# EAGLE design chipKIT Basic IO (EAGLE 5.11)

## Sheet 1 of 4
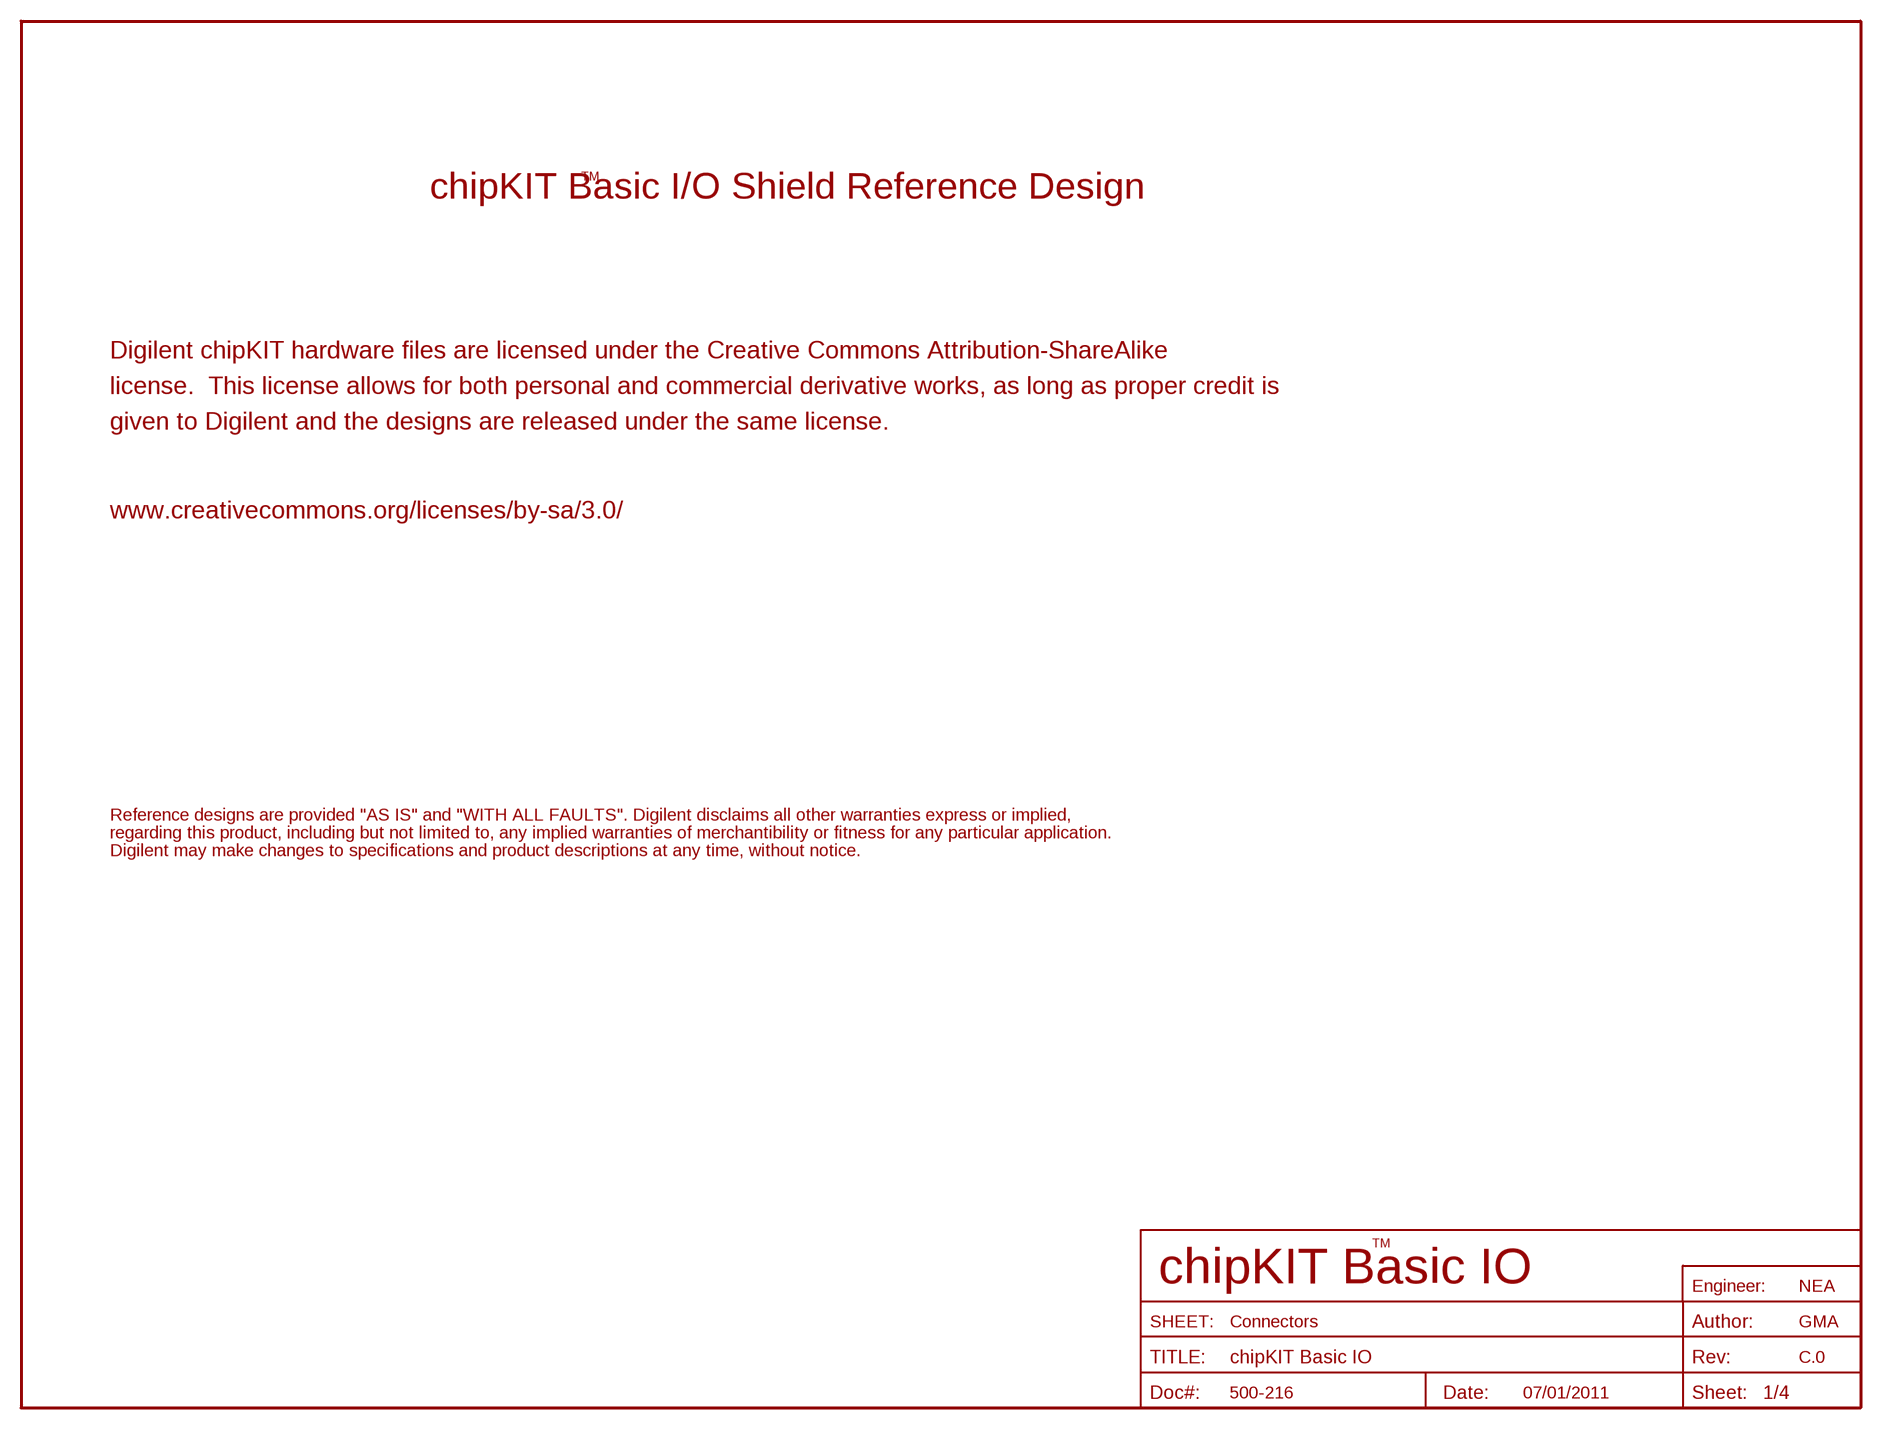
[diagram p0: schematic, sheet 1]

### Notes on the sheet
- TM
- chipKIT Basic I/O Shield Reference Design
- Digilent chipKIT hardware files are licensed under the Creative Commons Attribution-ShareAlike
- license.  This license allows for both personal and commercial derivative works, as long as proper credit is
- given to Digilent and the designs are released under the same license.
- www.creativecommons.org/licenses/by-sa/3.0/
- Reference designs are provided "AS IS" and "WITH ALL FAULTS". Digilent disclaims all other warranties express or implied,
- regarding this product, including but not limited to, any implied warranties of merchantibility or fitness for any particular application.
- Digilent may make changes to specifications and product descriptions at any time, without notice.
- TM
- chipKIT Basic IO
- NEA
- Connectors | GMA
- C.0
- 500-216 | 07/01/2011

## Sheet 2 of 4
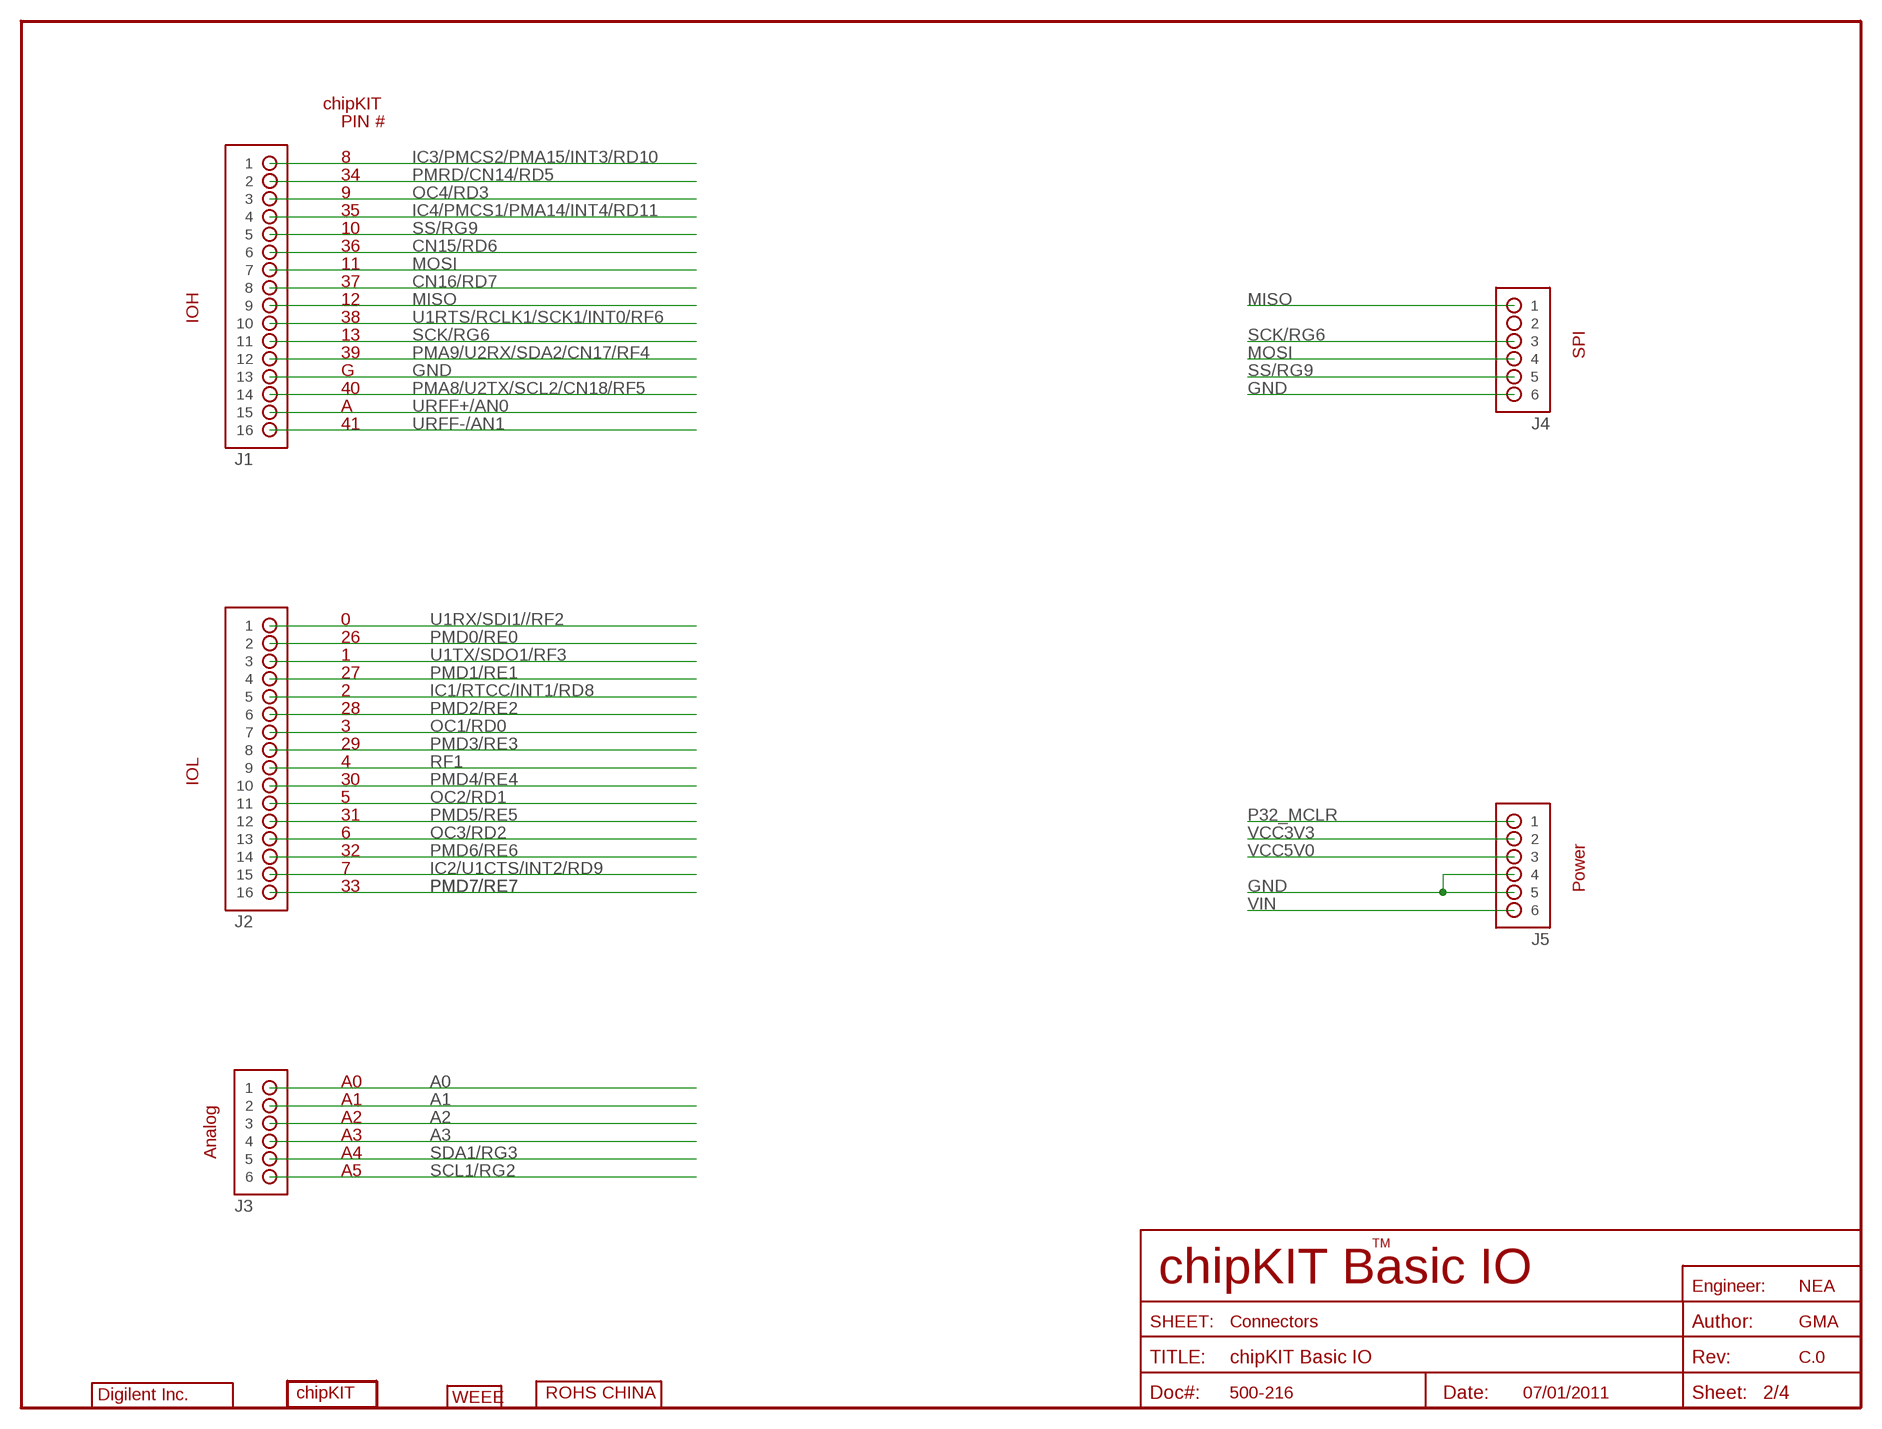
[diagram p1: schematic, sheet 2]

### Parts
J1  HDR-2X8  [HDR-2X8]
J2  HDR-2X8  [HDR-2X8]
J3  HDR-1X6  [HDR-1X6]
J4  No Load  HDR-2X3  [HDR-2X3]
J5  HDR-1X6  [HDR-1X6]
LOGO1  CHIPKIT  [CHIPKIT_LOGO]
LOGO2  DIGILENT_INC-1000  [DIGILENT_URL_1000_LOGO]
LOGO3  WEEE-L  [WEEE_LOGO2]
LOGO4  ROHS-CHINA  [ROHS_CHINA_LOGO]

### Nets
A0: J3.1 ; also sheet 4
A1: J3.2
A2: J3.3
A3: J3.4
CN15/RD6: J1.6 ; also sheet 3
CN16/RD7: J1.8 ; also sheet 3
GND: J1.13 J4.6 J5.4 J5.5 ; also sheet 3,4
IC1/RTCC/INT1/RD8: J2.5 ; also sheet 3
IC2/U1CTS/INT2/RD9: J2.15 ; also sheet 3
IC3/PMCS2/PMA15/INT3/RD10: J1.1 ; also sheet 3
IC4/PMCS1/PMA14/INT4/RD11: J1.4 ; also sheet 3
MISO: J1.9 J4.1
MOSI: J1.7 J4.4 ; also sheet 4
OC1/RD0: J2.7 ; also sheet 3
OC2/RD1: J2.11 ; also sheet 3
OC3/RD2: J2.13 ; also sheet 3
OC4/RD3: J1.3 ; also sheet 3
P32_MCLR: J5.1
PMA8/U2TX/SCL2/CN18/RF5: J1.14 ; also sheet 4
PMA9/U2RX/SDA2/CN17/RF4: J1.12 ; also sheet 4
PMD0/RE0: J2.2 ; also sheet 4
PMD1/RE1: J2.4 ; also sheet 4
PMD2/RE2: J2.6 ; also sheet 4
PMD3/RE3: J2.8 ; also sheet 4
PMD4/RE4: J2.10 ; also sheet 4
PMD5/RE5: J2.12 ; also sheet 4
PMD6/RE6: J2.14 ; also sheet 4
PMD7/RE7: J2.16 ; also sheet 4
PMRD/CN14/RD5: J1.2 ; also sheet 3
RF1: J2.9 ; also sheet 3
SCK/RG6: J1.11 J4.3 ; also sheet 4
SCL1/RG2: J3.6 ; also sheet 3,4
SDA1/RG3: J3.5 ; also sheet 3,4
SS/RG9: J1.5 J4.5 ; also sheet 4
U1RTS/RCLK1/SCK1/INT0/RF6: J1.10 ; also sheet 4
U1RX/SDI1//RF2: J2.1
U1TX/SDO1/RF3: J2.3
URFF+/AN0: J1.15
URFF-/AN1: J1.16
VCC3V3: J5.2 ; also sheet 3,4
VCC5V0: J5.3 ; also sheet 3
VIN: J5.6
Unconnected: J4.2

### Notes on the sheet
- chipKIT
- PIN #
- 8
- 34
- 9
- 35
- 10
- 36
- 11
- 37
- 12
- IOH | 38
- 13
- 39 | SPI
- G
- 40
- A
- 41
- 0
- 26
- 1
- 27
- 2
- 28
- 3
- 29
- 4
- IOL | 30
- 5
- 31
- 6
- 32
- 7
- 33 | Power
- A0
- A1
- A2
- A3
- Analog | A4
- A5
- TM
- chipKIT Basic IO
- NEA
- Connectors | GMA
- C.0
- 500-216 | 07/01/2011

## Sheet 3 of 4
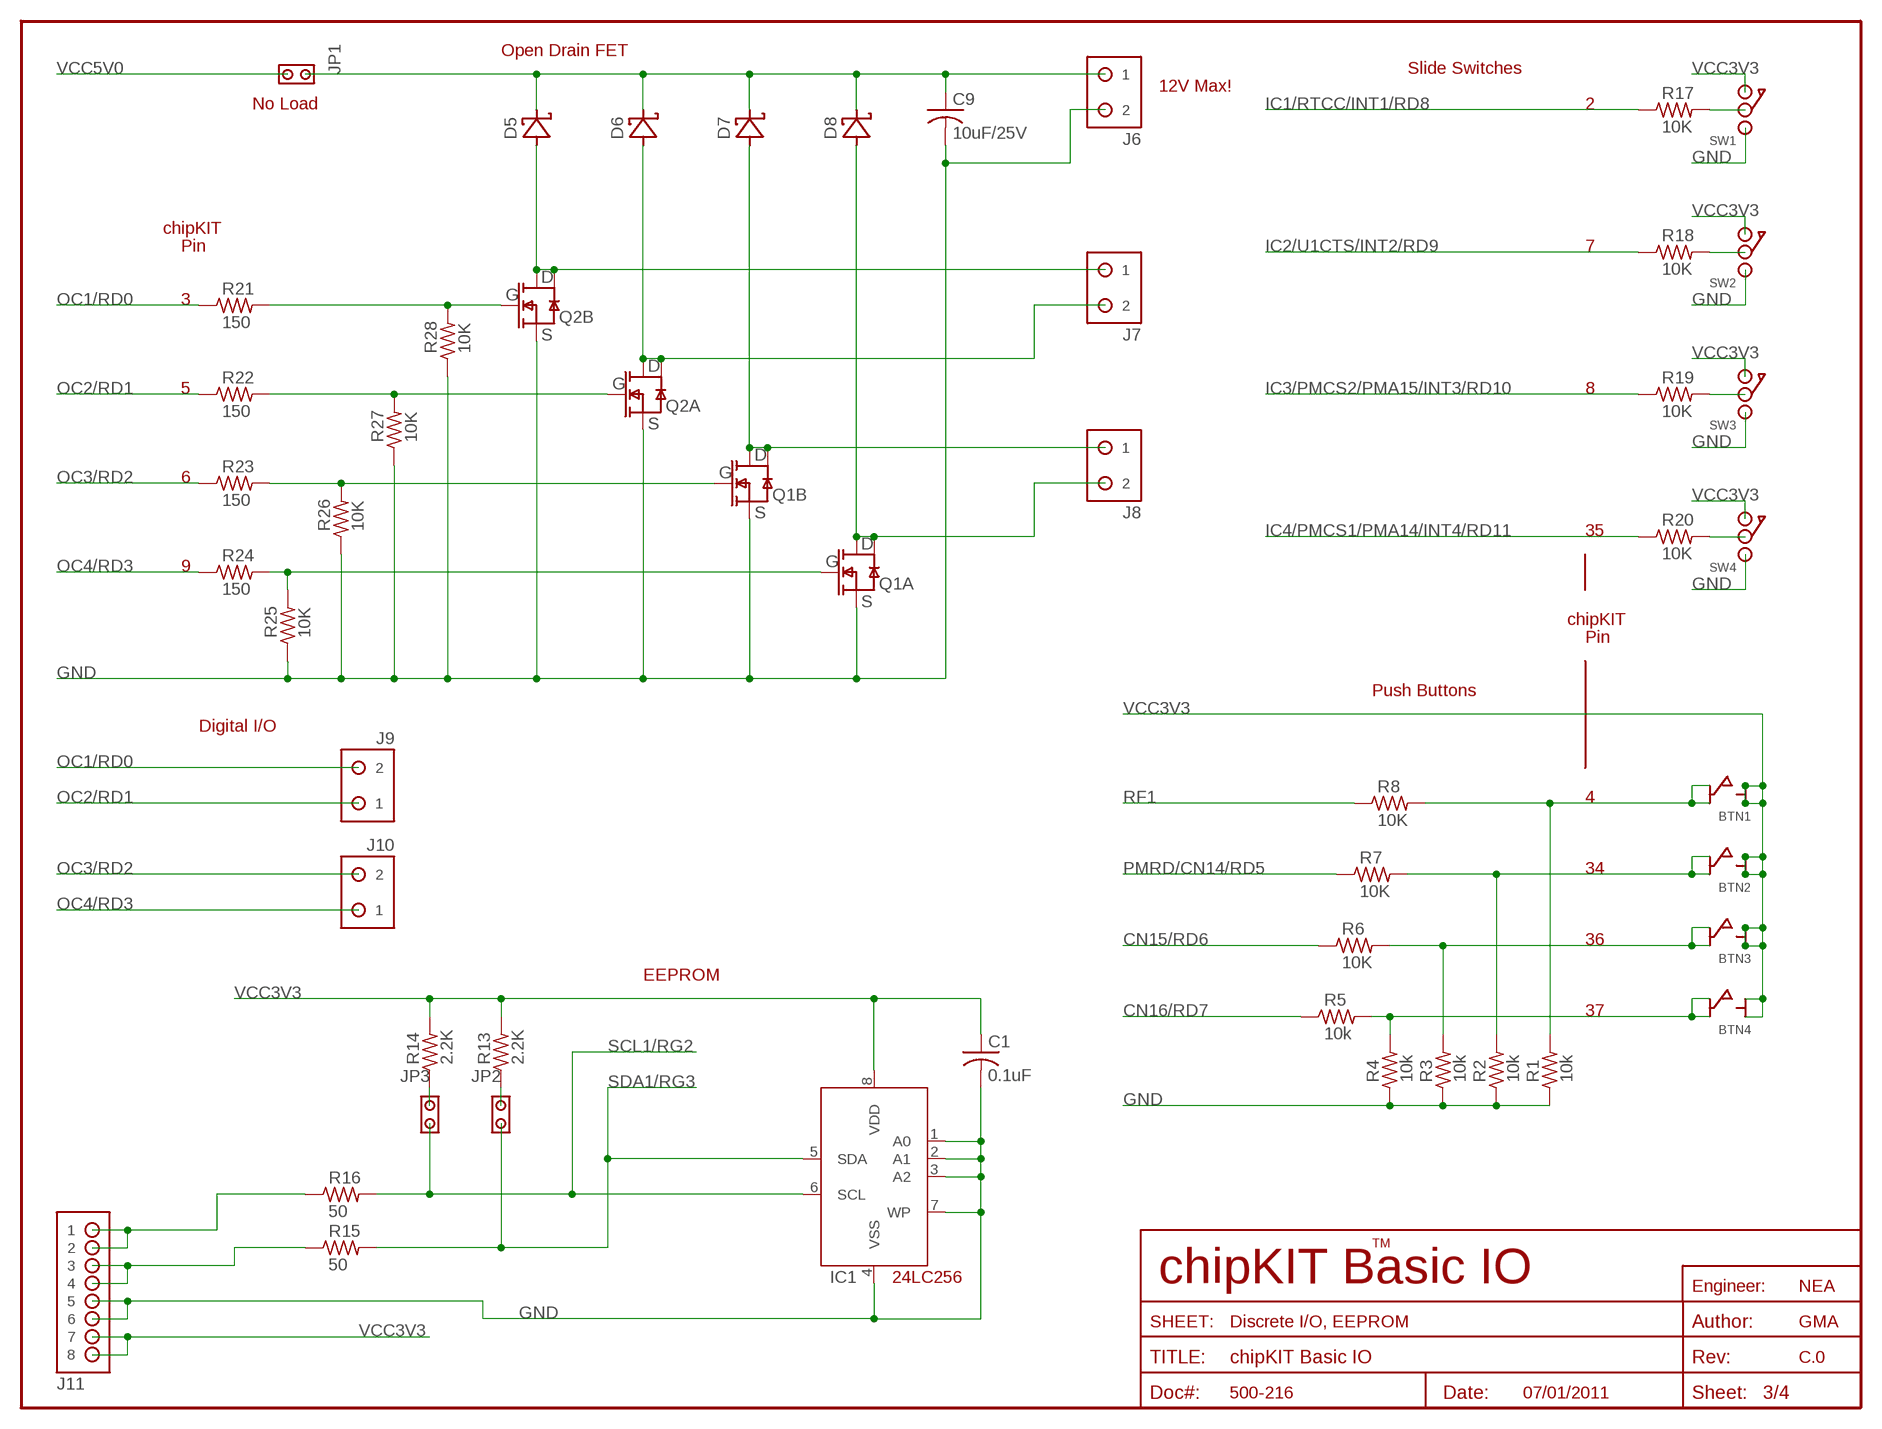
[diagram p2: schematic, sheet 3]

### Parts
BTN1  SW-P8008  [SW-P8008]
BTN2  SW-P8008  [SW-P8008]
BTN3  SW-P8008  [SW-P8008]
BTN4  SW-P8008  [SW-P8008]
C1  0.1uF  CAP-S0402S  [C0402S]
C9  10uF/25V  CAP-S1206S  [C1206S]
D5  MBR0520  [SOD-123]
D6  MBR0520  [SOD-123]
D7  MBR0520  [SOD-123]
D8  MBR0520  [SOD-123]
IC1  24LC256MS  [MSOP8-MS]
J6  TB-840502-2  [TB-840502-2]
J7  TB-840502-2  [TB-840502-2]
J8  TB-840502-2  [TB-840502-2]
J9  TB-840502-2  [TB-840502-2]
J10  TB-840502-2  [TB-840502-2]
J11  HDR-2X4  [HDR-2X4]
JP1  No Load  JPR-1X2  [JPR-1X2]
JP2  JPR-1X2  [JPR-1X2]
JP3  JPR-1X2  [JPR-1X2]
Q1  NTHD4508NT1  [CHIPFET]
Q2  NTHD4508NT1  [CHIPFET]
R1  10k  RES-S0402S  [R0402S]
R2  10k  RES-S0402S  [R0402S]
R3  10k  RES-S0402S  [R0402S]
R4  10k  RES-S0402S  [R0402S]
R5  10k  RES-S0402S  [R0402S]
R6  10K  RES-S0402S  [R0402S]
R7  10K  RES-S0402S  [R0402S]
R8  10K  RES-S0402S  [R0402S]
R13  2.2K  RES-S0402S  [R0402S]
R14  2.2K  RES-S0402S  [R0402S]
R15  50  RES-S0402S  [R0402S]
R16  50  RES-S0402S  [R0402S]
R17  10K  RES-S0402S  [R0402S]
R18  10K  RES-S0402S  [R0402S]
R19  10K  RES-S0402S  [R0402S]
R20  10K  RES-S0402S  [R0402S]
R21  150  RES-S0402S  [R0402S]
R22  150  RES-S0402S  [R0402S]
R23  150  RES-S0402S  [R0402S]
R24  150  RES-S0402S  [R0402S]
R25  10K  RES-S0402S  [R0402S]
R26  10K  RES-S0402S  [R0402S]
R27  10K  RES-S0402S  [R0402S]
R28  10K  RES-S0402S  [R0402S]
SW1  SW-10SP001  [SW-10SP001]
SW2  SW-10SP001  [SW-10SP001]
SW3  SW-10SP001  [SW-10SP001]
SW4  SW-10SP001  [SW-10SP001]

### Nets
CN15/RD6: R6.1 ; also sheet 2
CN16/RD7: R5.1 ; also sheet 2
GND: C1.2 C9.2 IC1.1(A0) IC1.2(A1) IC1.3(A2) IC1.4(VSS) IC1.7(WP) J6.2 J11.5 J11.6 Q1.1(A:S1) Q1.3(B:S1) Q2.1(A:S1) Q2.3(B:S1) R1.1 R2.1 R3.1 R4.1 R25.1 R26.1 R27.1 R28.1 SW1.3 SW2.3 SW3.3 SW4.3 ; also sheet 2,4
IC1/RTCC/INT1/RD8: R17.1 ; also sheet 2
IC2/U1CTS/INT2/RD9: R18.1 ; also sheet 2
IC3/PMCS2/PMA15/INT3/RD10: R19.1 ; also sheet 2
IC4/PMCS1/PMA14/INT4/RD11: R20.1 ; also sheet 2
N$1: BTN4.1A BTN4.2A R4.2 R5.2
N$4: BTN1.1A BTN1.2A R1.2 R8.2
N$5: BTN2.1A BTN2.2A R2.2 R7.2
N$6: BTN3.1A BTN3.2A R3.2 R6.2
N$22: R20.2 SW4.2
N$23: J11.3 J11.4 R15.1
N$24: J11.1 J11.2 R16.1
N$25: R19.2 SW3.2
N$26: R18.2 SW2.2
N$27: R17.2 SW1.2
N$34: C9.1 D5.1(C) D6.1(C) D7.1(C) D8.1(C) J6.1 JP1.2
N$36: D8.2(A) J8.2 Q1.7(A:D1B) Q1.8(A:D1A)
N$37: D7.2(A) J8.1 Q1.5(B:D1B) Q1.6(B:D1A)
N$38: D5.2(A) J7.1 Q2.5(B:D1B) Q2.6(B:D1A)
N$39: D6.2(A) J7.2 Q2.7(A:D1B) Q2.8(A:D1A)
N$40: Q2.4(B:G1) R21.2 R28.2
N$41: Q2.2(A:G1) R22.2 R27.2
N$42: Q1.4(B:G1) R23.2 R26.2
N$43: Q1.2(A:G1) R24.2 R25.2
N$83: JP3.2 R14.1
N$84: JP2.2 R13.1
OC1/RD0: J9.2 R21.1 ; also sheet 2
OC2/RD1: J9.1 R22.1 ; also sheet 2
OC3/RD2: J10.2 R23.1 ; also sheet 2
OC4/RD3: J10.1 R24.1 ; also sheet 2
PMRD/CN14/RD5: R7.1 ; also sheet 2
RF1: R8.1 ; also sheet 2
SCL1/RG2: IC1.6(SCL) JP3.1 R16.2 ; also sheet 2,4
SDA1/RG3: IC1.5(SDA) JP2.1 R15.2 ; also sheet 2,4
VCC3V3: BTN1.1B BTN1.2B BTN2.1B BTN2.2B BTN3.1B BTN3.2B BTN4.1B BTN4.2B C1.1 IC1.8(VDD) J11.7 J11.8 R13.2 R14.2 SW1.1 SW2.1 SW3.1 SW4.1 ; also sheet 2,4
VCC5V0: JP1.1 ; also sheet 2

### Notes on the sheet
- Open Drain FET
- Slide Switches
- 12V Max!
- No Load | 2
- chipKIT
- Pin | 7
- 3
- 5 | 8
- 6
- 35
- 9
- chipKIT
- Pin
- Push Buttons
- Digital I/O
- 4
- 34
- 36
- EEPROM
- 37
- TM
- 24LC256 | chipKIT Basic IO
- NEA
- Discrete I/O, EEPROM | GMA
- C.0
- 500-216 | 07/01/2011

## Sheet 4 of 4
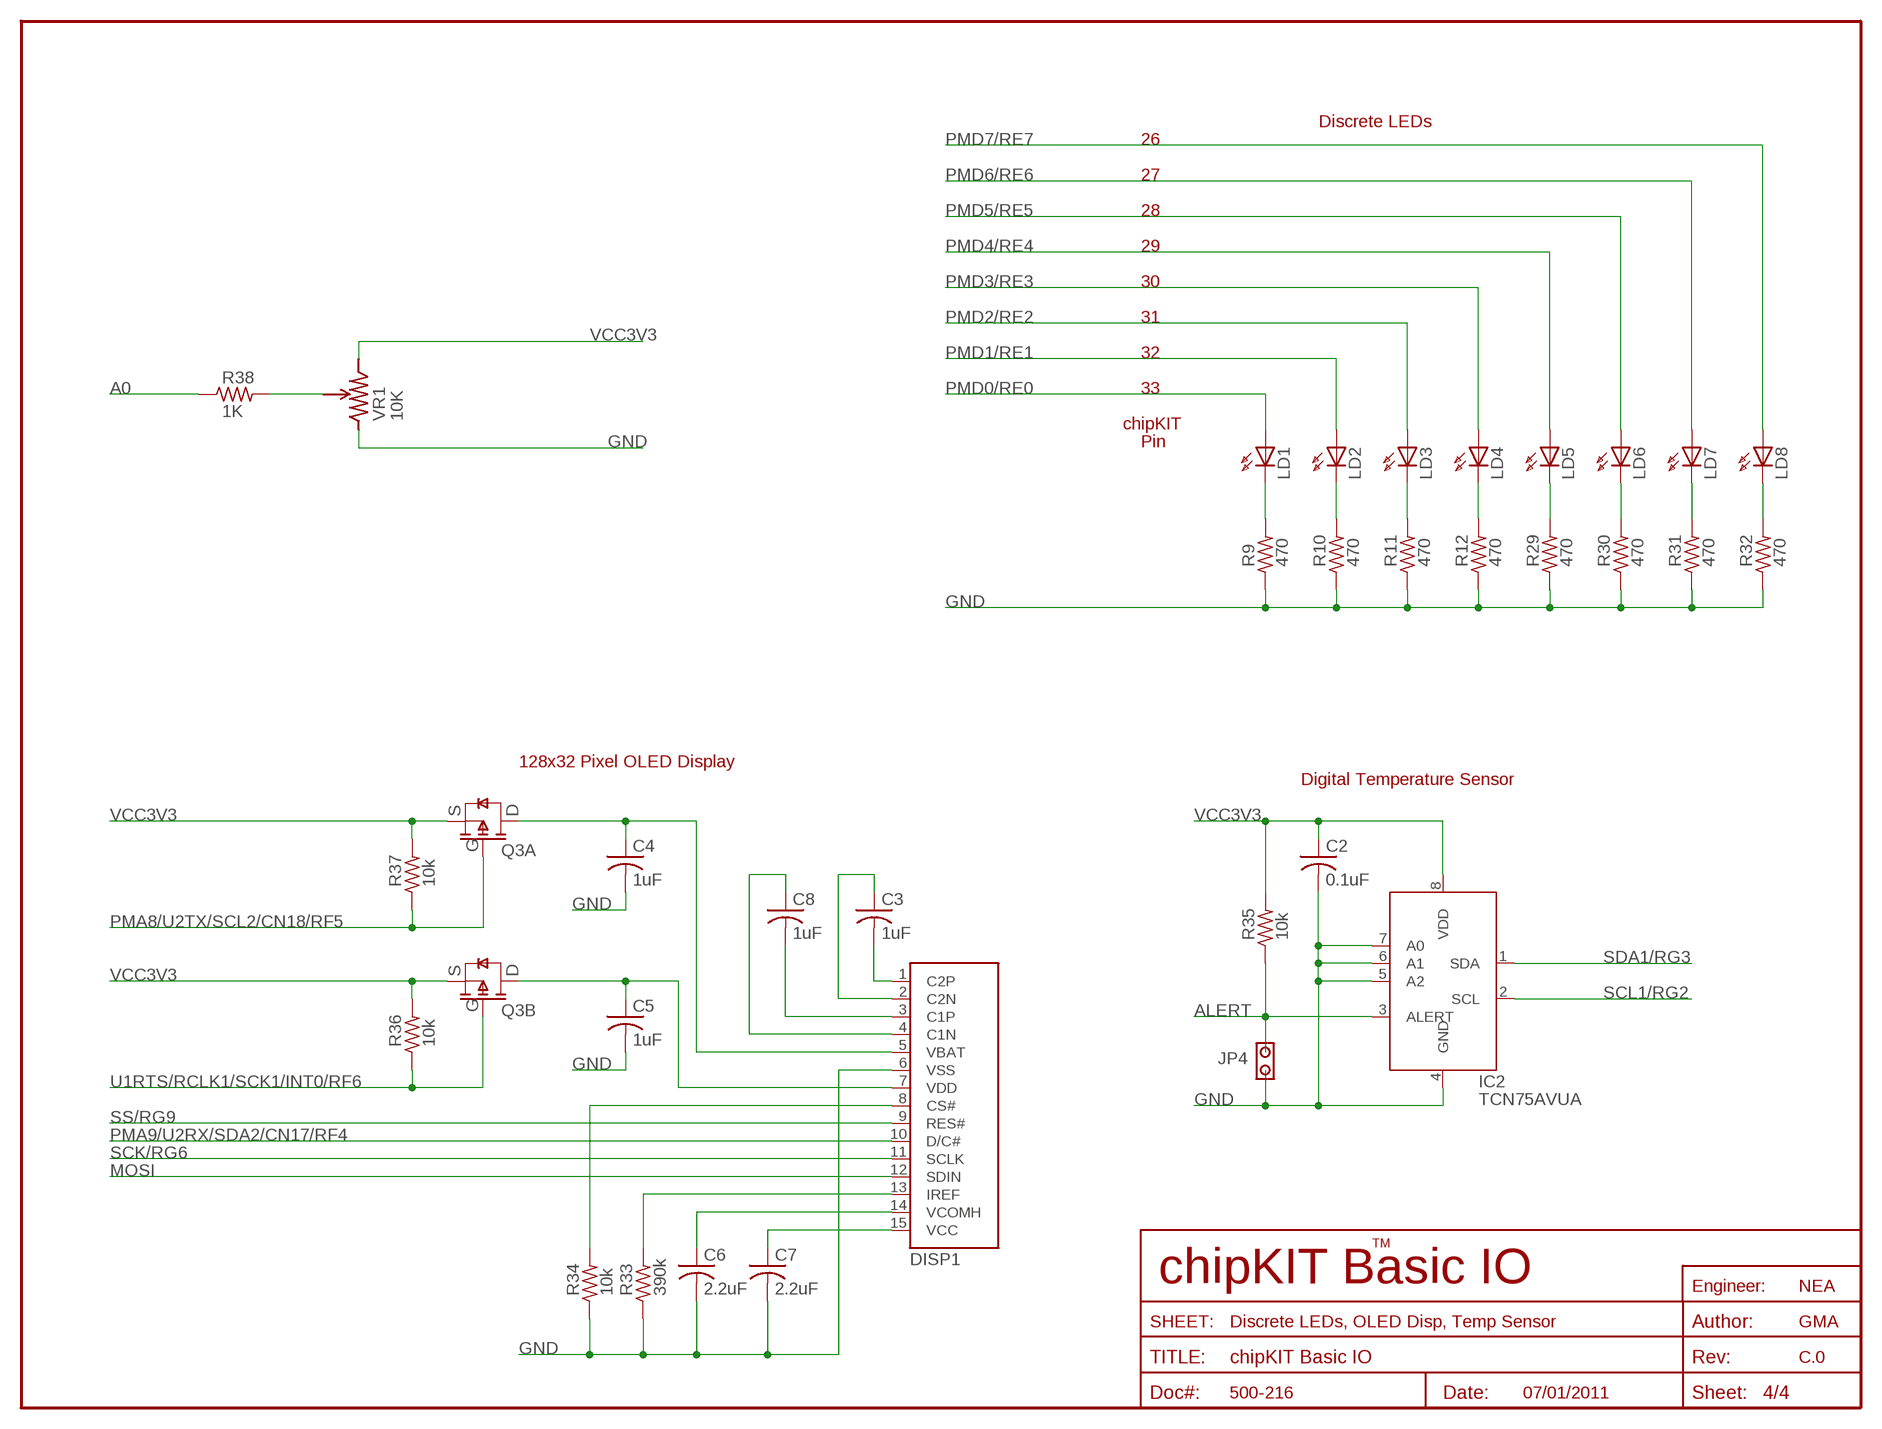
[diagram p3: schematic, sheet 4]

### Parts
C2  0.1uF  CAP-S0402S  [C0402S]
C3  1uF  CAP-S0402S  [C0402S]
C4  1uF  CAP-S0402S  [C0402S]
C5  1uF  CAP-S0402S  [C0402S]
C6  2.2uF  CAP-S0603S  [C0603S]
C7  2.2uF  CAP-S0603S  [C0603S]
C8  1uF  CAP-S0402S  [C0402S]
DISP1  UG-2832HSWEG04  [UG-2832HSWEG04]
IC2  TCN75AVUA  [MSOP8-MS]
JP4  JPR-1X2  [JPR-1X2]
LD1  LED-S0603  [D0603]
LD2  LED-S0603  [D0603]
LD3  LED-S0603  [D0603]
LD4  LED-S0603  [D0603]
LD5  LED-S0603  [D0603]
LD6  LED-S0603  [D0603]
LD7  LED-S0603  [D0603]
LD8  LED-S0603  [D0603]
Q3  BSS84DW  [SOT-363]
R9  470  RES-S0402S  [R0402S]
R10  470  RES-S0402S  [R0402S]
R11  470  RES-S0402S  [R0402S]
R12  470  RES-S0402S  [R0402S]
R29  470  RES-S0402S  [R0402S]
R30  470  RES-S0402S  [R0402S]
R31  470  RES-S0402S  [R0402S]
R32  470  RES-S0402S  [R0402S]
R33  390k  RES-S0402S  [R0402S]
R34  10k  RES-S0402S  [R0402S]
R35  10k  RES-S0402S  [R0402S]
R36  10k  RES-S0402S  [R0402S]
R37  10k  RES-S0402S  [R0402S]
R38  1K  RES-S0402S  [R0402S]
VR1  10K  POT-3352T  [BOURNS-3352T]

### Nets
A0: R38.1 ; also sheet 2
ALERT: IC2.3(ALERT) JP4.2 R35.1
GND: C2.2 C4.2 C5.2 C6.2 C7.2 DISP1.6(VSS) IC2.4(GND) IC2.5(A2) IC2.6(A1) IC2.7(A0) JP4.1 R9.1 R10.1 R11.1 R12.1 R29.1 R30.1 R31.1 R32.1 R33.1 R34.1 VR1.1 ; also sheet 2,3
MOSI: DISP1.12(SDIN) ; also sheet 2
N$2: DISP1.8(CS#) R34.2
N$3: R38.2 VR1.2
N$11: LD4.C R12.2
N$12: LD3.C R11.2
N$13: LD2.C R10.2
N$14: LD1.C R9.2
N$15: C3.2 DISP1.1(C2P)
N$16: C7.1 DISP1.15(VCC)
N$17: C3.1 DISP1.2(C2N)
N$18: C6.1 DISP1.14(VCOMH)
N$19: C8.2 DISP1.3(C1P)
N$20: DISP1.13(IREF) R33.2
N$21: C8.1 DISP1.4(C1N)
N$29: C5.1 DISP1.7(VDD) Q3.3(B:D)
N$53: LD5.C R29.2
N$58: LD6.C R30.2
N$61: LD7.C R31.2
N$63: LD8.C R32.2
PMA8/U2TX/SCL2/CN18/RF5: Q3.2(A:G) R37.1 ; also sheet 2
PMA9/U2RX/SDA2/CN17/RF4: DISP1.10(D/C#) ; also sheet 2
PMD0/RE0: LD1.A ; also sheet 2
PMD1/RE1: LD2.A ; also sheet 2
PMD2/RE2: LD3.A ; also sheet 2
PMD3/RE3: LD4.A ; also sheet 2
PMD4/RE4: LD5.A ; also sheet 2
PMD5/RE5: LD6.A ; also sheet 2
PMD6/RE6: LD7.A ; also sheet 2
PMD7/RE7: LD8.A ; also sheet 2
SCK/RG6: DISP1.11(SCLK) ; also sheet 2
SCL1/RG2: IC2.2(SCL) ; also sheet 2,3
SDA1/RG3: IC2.1(SDA) ; also sheet 2,3
SS/RG9: DISP1.9(RES#) ; also sheet 2
U1RTS/RCLK1/SCK1/INT0/RF6: Q3.5(B:G) R36.1 ; also sheet 2
VBAT: C4.1 DISP1.5(VBAT) Q3.6(A:D)
VCC3V3: C2.1 IC2.8(VDD) Q3.1(A:S) Q3.4(B:S) R35.2 R36.2 R37.2 VR1.3 ; also sheet 2,3

### Notes on the sheet
- Discrete LEDs
- 26
- 27
- 28
- 29
- 30
- 31
- 32
- 33
- chipKIT
- Pin
- 128x32 Pixel OLED Display
- Digital Temperature Sensor
- TM
- chipKIT Basic IO
- NEA
- Discrete LEDs, OLED Disp, Temp Sensor | GMA
- C.0
- 500-216 | 07/01/2011

## Library data of the parts
BTN1-BTN4 = Digilent:SW-P8008: 153-000: SPST, Push button, momentary
C1-C9 = Discrete:CAP: Capacitor
D5-D8 = Discrete:MBR0520: Shottkey Power Rectifier
DISP1 = Disp:UG-2832HSWEG04: Univisiont Technology UG-2832HSWEG04 128x32 Monochrome, Passive Matrix OLED Module
IC1 = Microchip:24*256: 256K I2C CMOS Serial EEPROM
IC2 = Microchip:TCN75A
J1 J2 = Mechanical:HDR-2X8: 100mil 2x8 header
J3 J5 = Mechanical:HDR-1X6
J4 = Mechanical:HDR-2X3
J6-J10 = Mechanical:TB-840502-2: Terminal Block, screw contact
J11 = Mechanical:HDR-2X4
JP1-JP4 = Mechanical:JPR-1X2
LD1-LD8 = Discrete:LED: Discrete LED
LOGO1 = Logo:CHIPKIT: Microchip chipKIT Logo
LOGO2 = Logo:DIGILENT_INC
LOGO3 = Logo:WEEE: WEEE Symbol
LOGO4 = Logo:ROHS-CHINA: Chinese ROHS symbol logo
Q1 Q2 = Discrete:NTHD4508N: On-Semi Power MOFSET, 20V, 4.1A, Dual N-Channel
Q3 = Discrete:BSS84DW: Dual P-Channel Transisto, Diodes INC
R1-R38 = Discrete:RES: Resistor
SW1-SW4 = Mechanical:SW-10SP001: 153-001: SPDT Subminiature Slide Switch
VR1 = Discrete:POT

## Board
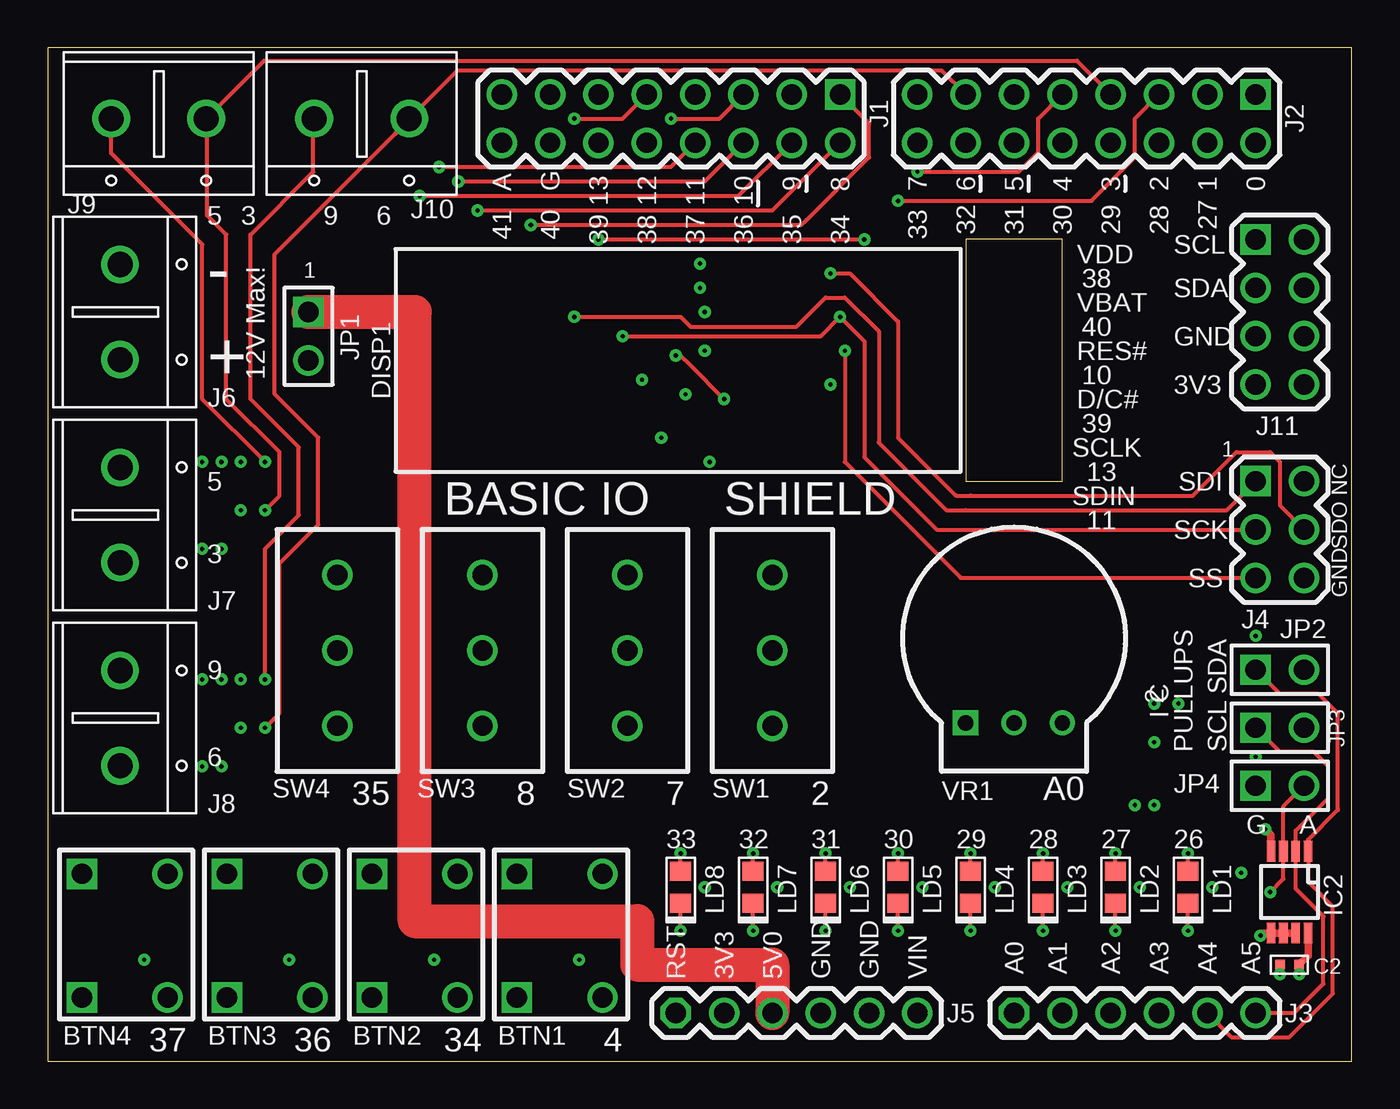
[diagram p4: board, top side]
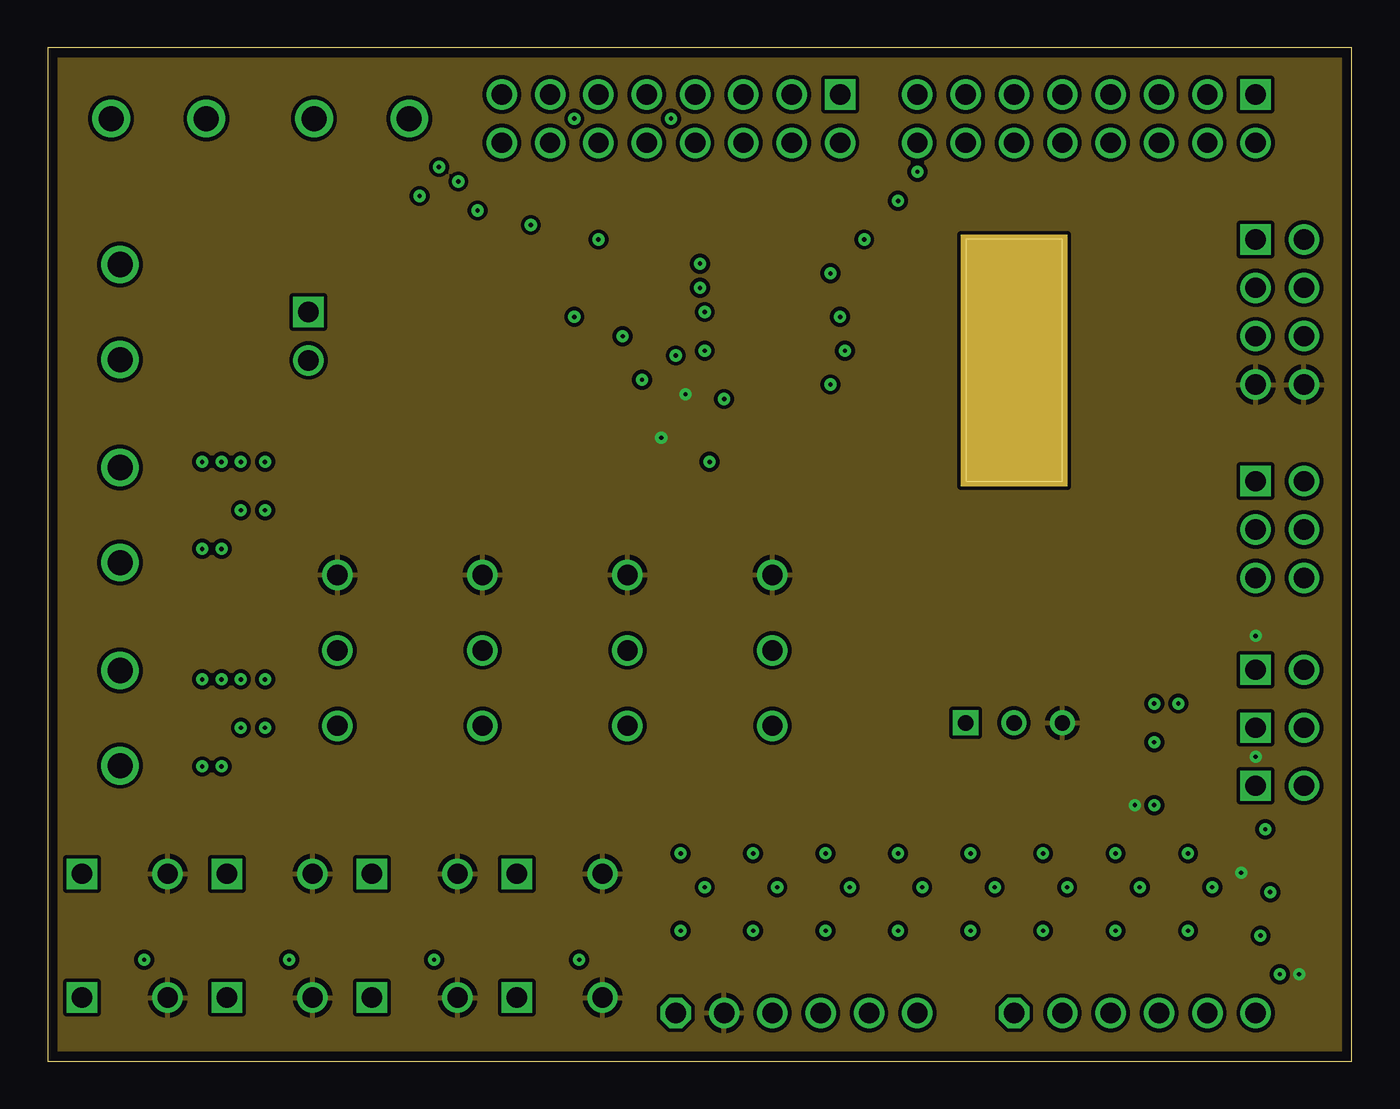
[diagram p5: board, inner layer Route2]
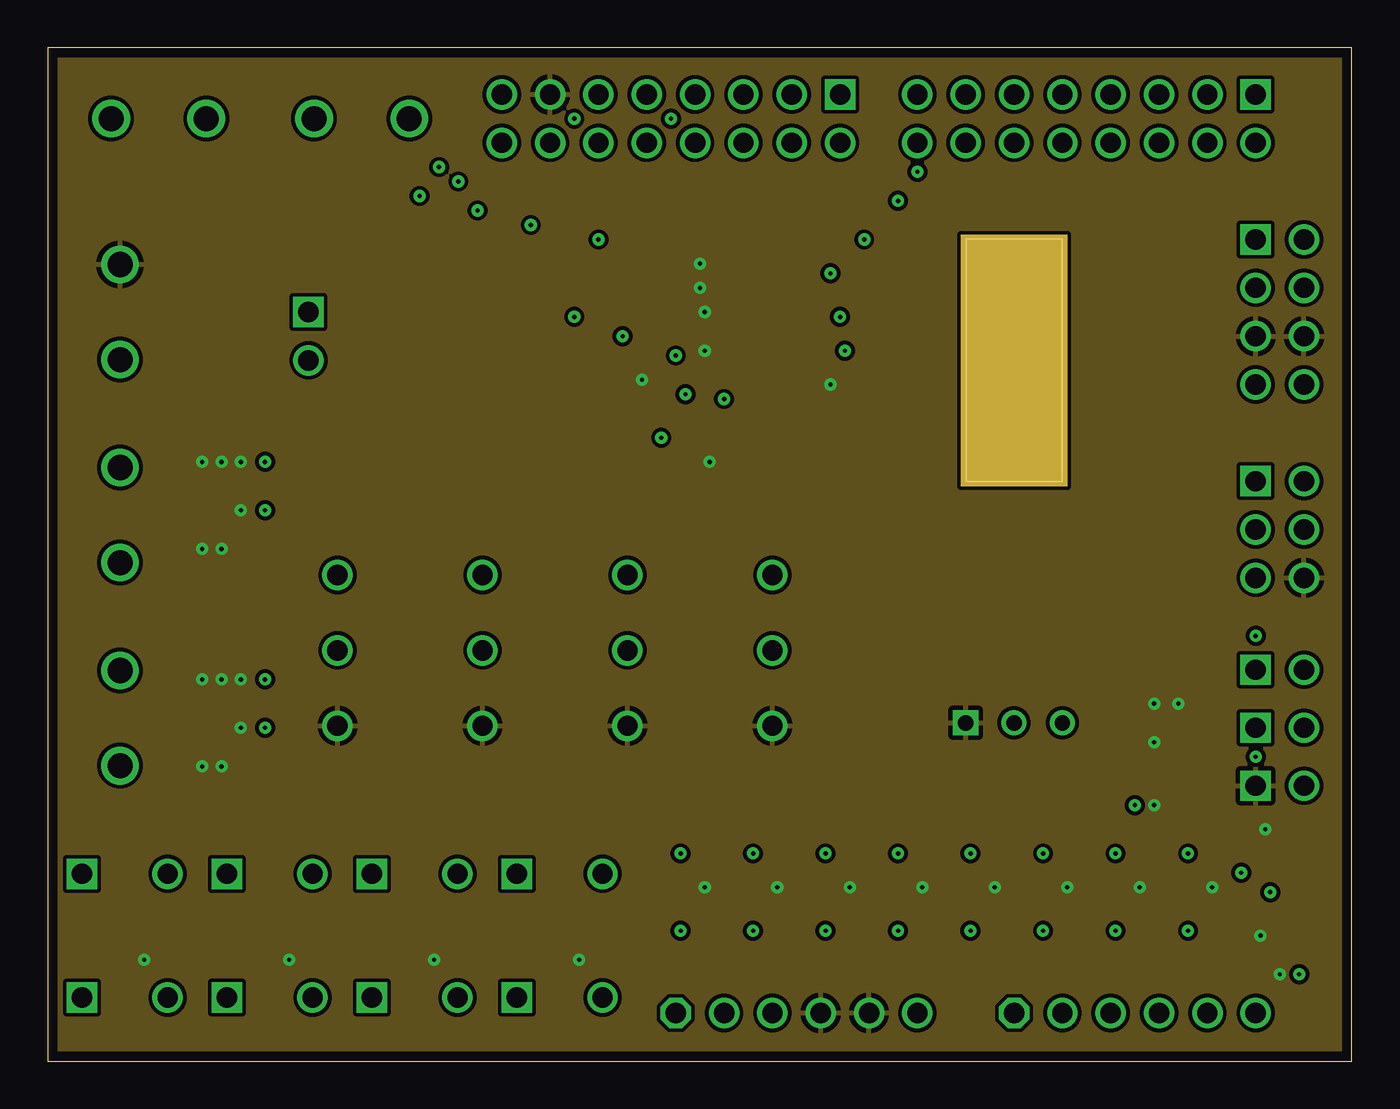
[diagram p6: board, inner layer Route15]
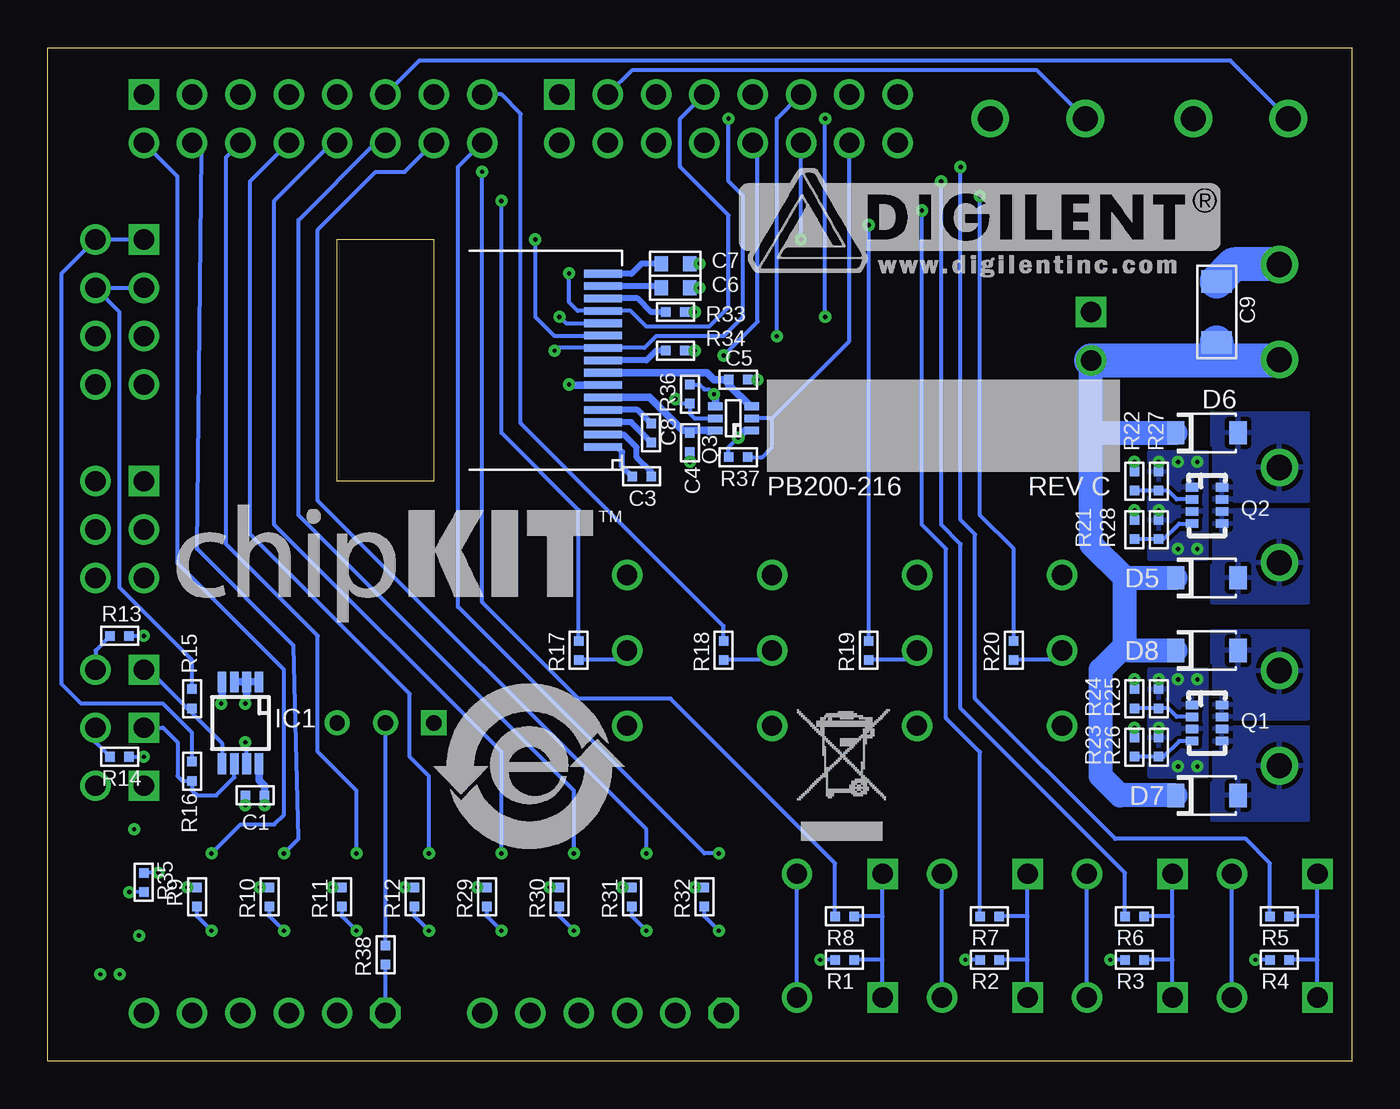
[diagram p7: board, bottom side, seen from below]

Size 68.56 x 53.26 mm. Coordinates in mm from the lower left corner, seen from the top.
Outline: 0,0 68.56,0 68.56,53.26 0,53.26 0,0
Copper layers (1*2*15*16): Top 0.035mm / dielectric 1.5mm / Route2 0.035mm / dielectric 0.15mm / Route15 0.035mm / dielectric 0.2mm / Bottom 0.035mm
Design rules "default *": minimum track width 8mil, minimum drill 9mil, track to track 8mil, track to pad 6mil, pad to pad 6mil, via to via 8mil, smd to smd 6mil, copper to edge 20mil, drill to drill 8mil, minimum pad ring 10mil, minimum via ring 8mil, stop-mask expansion 4mil, vias tented up to drill 15mil, thermal gap 10mil
Milling: area 48.3,30.5 to 53.3,43.2

### Footprints (pad centres in the part's own frame; a part is rotated, then mirrored left to right if it is on the bottom)
SW-P8008 = drill 1.067 square: 1A -2,3.5; 2A -2,-3 | drill 1.067 round: 1B 2.5,3.5; 2B 2.5,-3
C0402S = smd 0.5 x 0.5: 1 -0.5,0; 2 0.5,0
C0603S = smd 0.7 x 0.8: 1 -0.75,0; 2 0.75,0
C1206S = smd 1.2 x 1.6: 1 -1.6,0; 2 1.6,0
SOD-123 = smd 0.914 x 1.219: 1 -1.638,0; 2 1.638,0
UG-2832HSWEG04 = smd 2 x 0.4: 1 0,-4.55; 2 0,-3.9; 3 0,-3.25; 4 0,-2.6; 5 0,-1.95; 6 0,-1.3; 7 0,-0.65; 8 0,0; 9 0,0.65; 10 0,1.3; 11 0,1.95; 12 0,2.6; 13 0,3.25; 14 0,3.9; 15 0,4.55
MSOP8-MS = smd 0.45 x 1.1: 1 -0.975,-2.15; 2 -0.325,-2.15; 3 0.325,-2.15; 4 0.975,-2.15; 5 0.975,2.15; 6 0.325,2.15; 7 -0.325,2.15; 8 -0.975,2.15
HDR-2X8 = drill 1.067 square: 1 -1.27,8.89 | drill 1.067 round: 2 1.27,8.89; 3 -1.27,6.35; 4 1.27,6.35; 5 -1.27,3.81; 6 1.27,3.81; 7 -1.27,1.27; 8 1.27,1.27; 9 -1.27,-1.27; 10 1.27,-1.27; 11 -1.27,-3.81; 12 1.27,-3.81; 13 -1.27,-6.35; 14 1.27,-6.35; 15 -1.27,-8.89; 16 1.27,-8.89
HDR-1X6 = drill 1.067 octagon: 1 0,6.35 | drill 1.067 round: 2 0,3.81; 3 0,1.27; 4 0,-1.27; 5 0,-3.81; 6 0,-6.35
HDR-2X3 = drill 1.067 square: 1 -1.27,2.54 | drill 1.067 round: 2 1.27,2.54; 3 -1.27,0; 4 1.27,0; 5 -1.27,-2.54; 6 1.27,-2.54
TB-840502-2 = drill 1.321 round: 1 -2.5,0; 2 2.5,0
HDR-2X4 = drill 1.067 square: 1 -1.27,3.81 | drill 1.067 round: 2 1.27,3.81; 3 -1.27,1.27; 4 1.27,1.27; 5 -1.27,-1.27; 6 1.27,-1.27; 7 -1.27,-3.81; 8 1.27,-3.81
JPR-1X2 = drill 1.067 square: 1 0,1.27 | drill 1.067 round: 2 0,-1.27
D0603 = smd 1 x 1.1: A 0.85,0; C -0.85,0
CHIPFET = smd 0.66 x 0.45: 1 -0.785,0.952; 2 -0.785,0.317; 3 -0.785,-0.318; 4 -0.785,-0.953; 5 0.786,-0.953; 6 0.786,-0.318; 7 0.786,0.317; 8 0.786,0.952
SOT-363 = smd 0.4 x 0.762: 1 -0.635,-0.953; 2 0,-0.953; 3 0.635,-0.953; 4 0.635,0.953; 5 0,0.953; 6 -0.635,0.953
R0402S = smd 0.5 x 0.5: 1 -0.5,0; 2 0.5,0
SW-10SP001 = drill 1.067 round: 1 0,3.962; 2 0,0; 3 0,-3.962
BOURNS-3352T = drill 0.813 square: 1 -2.54,0 | drill 0.813 round: 2 0,0; 3 2.54,0

### Placement (x,y rotation side)
BTN1  26.67,6.35 0 top
BTN2  19.05,6.35 0 top
BTN3  11.43,6.35 0 top
BTN4  3.81,6.35 0 top
C1  57.66,13.97 180 bottom
C2  65.28,5.08 180 top
C3  37.34,30.73 180 bottom
C4  34.8,32.51 270 bottom
C5  32.26,35.81 0 bottom
C6  35.56,40.64 0 bottom
C7  35.56,41.91 0 bottom
C8  36.83,33.02 270 bottom
C9  7.11,39.37 90 bottom
D5  7.62,25.4 0 bottom
D6  7.62,33.02 0 bottom
D7  7.62,13.97 0 bottom
D8  7.62,21.59 0 bottom
DISP1  39.37,36.83 0 bottom
IC1  58.42,17.78 180 bottom
IC2  65.28,8.89 180 top
J1  32.77,49.53 270 top
J2  54.61,49.53 270 top
J3  57.15,2.54 90 top
J4  64.77,27.94 0 top
J5  39.37,2.54 90 top
J6  3.81,39.37 90 top
J7  3.81,28.7 90 top
J8  3.81,18.03 90 top
J9  5.84,49.53 0 top
J10  16.51,49.53 0 top
J11  64.77,39.37 0 top
JP1  13.72,38.1 0 top
JP2  64.77,20.57 90 top
JP3  64.77,17.53 90 top
JP4  64.77,14.48 90 top
LD1  59.94,9.14 90 top
LD2  56.13,9.14 90 top
LD3  52.32,9.14 90 top
LD4  48.51,9.14 90 top
LD5  44.7,9.14 90 top
LD6  40.89,9.14 90 top
LD7  37.08,9.14 90 top
LD8  33.27,9.14 90 top
LOGO1  61.72,23.11 0 bottom
LOGO2  32.26,41.15 0 bottom
LOGO3  30.23,10.92 0 bottom
LOGO4  49.28,10.41 0 bottom
Q1  7.62,17.78 0 bottom
Q2  7.62,29.21 0 bottom
Q3  32.51,33.78 90 bottom
R1  26.67,5.33 0 bottom
R2  19.05,5.33 0 bottom
R3  11.43,5.33 0 bottom
R4  3.81,5.33 0 bottom
R5  3.81,7.62 0 bottom
R6  11.43,7.62 0 bottom
R7  19.05,7.62 0 bottom
R8  26.67,7.62 0 bottom
R9  60.71,8.64 270 bottom
R10  56.9,8.64 270 bottom
R11  53.09,8.64 270 bottom
R12  49.28,8.64 270 bottom
R13  64.77,22.35 0 bottom
R14  64.77,16 0 bottom
R15  60.96,19.05 270 bottom
R16  60.96,15.24 270 bottom
R17  40.64,21.59 270 bottom
R18  33.02,21.59 270 bottom
R19  25.4,21.59 270 bottom
R20  17.78,21.59 270 bottom
R21  11.43,27.94 270 bottom
R22  11.43,30.48 270 bottom
R23  11.43,16.51 270 bottom
R24  11.43,19.05 270 bottom
R25  10.16,19.05 270 bottom
R26  10.16,16.51 270 bottom
R27  10.16,30.48 270 bottom
R28  10.16,27.94 270 bottom
R29  45.47,8.64 270 bottom
R30  41.66,8.64 270 bottom
R31  37.85,8.64 270 bottom
R32  34.04,8.64 270 bottom
R33  35.56,39.37 180 bottom
R34  35.56,37.34 180 bottom
R35  63.5,9.4 90 bottom
R36  34.8,35.05 90 bottom
R37  32.26,31.75 180 bottom
R38  50.8,5.59 90 bottom
SW1  38.1,21.59 0 top
SW2  30.48,21.59 0 top
SW3  22.86,21.59 0 top
SW4  15.24,21.59 0 top
VR1  50.8,17.78 0 top

### Tracks (layer width: path | path; a pad name or v marks a point on that pad's centre or on a via)
A0
  Bottom 0.203: J3.1 R38.1
ALERT  (via drill 0.23 pad 0.61)
  Top 0.203: v64.26,8.89 64.95,9.58 IC2.3 64.95,13.39 JP4.2
  Bottom 0.203: R35.1 v64.26,8.89
CN15/RD6  (via drill 0.23 pad 0.61)
  Top 0.203: v21.59,46.23 34.54,46.23 J1.6
  Bottom 0.203: R6.1 11.93,9.9 20.57,18.54 20.57,27.18 21.59,28.19 v21.59,46.23
CN16/RD7  (via drill 0.23 pad 0.61)
  Top 0.203: v20.57,46.99 32.77,46.99 J1.8
  Bottom 0.203: R5.1 4.31,10.41 5.59,11.68 12.45,11.68 19.81,19.05 19.81,27.69 20.57,28.45 v20.57,46.99
GND  (via drill 0.23 pad 0.61)
  Top 0.406: C2.2 v64.78,4.58 v64.77,4.57 | IC2.7 IC2.6 IC2.5 63.89,6.74 v63.75,6.6 | IC2.4 64.3,11.9 v64.01,12.19
  Bottom 0.203: R4.1 v5.08,5.33 | R3.1 v12.7,5.33 | R2.1 v20.32,5.33 | R1.1 v27.94,5.33 | R11.1 v53.59,9.14 | R12.1 v49.78,9.14 | R32.1 v34.54,9.14 | R31.1 v38.35,9.14 | R30.1 v42.16,9.14 | R29.1 v45.97,9.14 | R10.1 v57.4,9.14 | R9.1 v61.21,9.14 | IC1.7 58.09,16.69 v58.17,16.76
  Bottom 0.305: R34.1 v34.54,37.34 | R33.1 v34.54,39.37 | C7.2 v34.29,41.91 | C6.2 v34.29,40.64
  Bottom 0.406: C4.2 v34.8,31.5 | DISP1.6 41.12,35.53 v41.15,35.56 | C5.2 v31.24,35.81 | IC1.4 59.4,18.84 v59.44,18.8 | IC1.2 IC1.3 | IC1.1 IC1.2 | IC1.2 58.09,18.87 v58.17,18.8 | C1.2 58.16,13.47 v58.17,13.46 | R26.1 v10.16,17.53
  Bottom 1.778: J6.2 6.21,41.87 C9.2
  other vias: 8.13,20.07 9.14,20.07 10.16,20.07 8.13,15.49 9.14,15.49 8.13,31.5 9.14,31.5 10.16,31.5 8.13,26.92 9.14,26.92 10.16,28.96
  pour Route15: 0,53.34 68.58,53.34 68.58,0 0,0
  pour Bottom (rank 2): 7.62,20.57 10.67,20.57 10.67,14.99 7.62,14.99
  pour Bottom (rank 2): 7.87,32 10.67,32 10.67,26.42 7.87,26.42 7.62,26.42 7.62,32
IC1/RTCC/INT1/RD8  (via drill 0.23 pad 0.61)
  Top 0.203: J2.5 57.15,49.53 57.15,47.5 54.86,45.21 v44.7,45.21
  Bottom 0.203: R17.1 40.64,28.96 44.7,33.02 v44.7,45.21
IC2/U1CTS/INT2/RD9
  Bottom 0.203: R18.1 33.02,22.86 43.69,33.53 43.69,49.78 44.7,50.8 J2.15
IC3/PMCS2/PMA15/INT3/RD10  (via drill 0.23 pad 0.61)
  Top 0.203: v25.4,43.94 39.62,43.94 39.88,44.2 43.18,47.5 43.18,49.28 J1.1
  Bottom 0.203: R19.1 v25.4,43.94
IC4/PMCS1/PMA14/INT4/RD11  (via drill 0.23 pad 0.61)
  Top 0.203: v19.56,45.47 36.32,45.47 J1.4
  Bottom 0.203: R20.1 17.78,26.92 19.56,28.7 v19.56,45.47
MISO  (via drill 0.23 pad 0.61)
  Top 0.203: J1.9 30.23,49.53 v27.69,49.53 | v27.69,39.12 33.27,39.12 33.78,38.61 39.37,38.61 40.89,40.13 41.91,40.13 43.69,38.35 43.69,32.51 47.24,28.96 48.26,28.96 61.98,28.96 J4.1
  Bottom 0.203: v27.69,39.12 v27.69,49.53
MOSI  (via drill 0.23 pad 0.61)
  Top 0.203: J4.4 64.77,29.21 64.77,31.5 64.26,32 62.48,32 60.2,29.72 48.51,29.72 47.75,29.72 44.7,32.77 44.7,38.86 42.16,41.4 v41.15,41.4
  Bottom 0.203: J1.7 35.31,49.53 35.31,46.99 32.77,44.45 32.77,39.62 33.78,38.61 37.08,38.61 37.91,39.43 DISP1.12 40.7,39.43 41.15,39.88 v41.15,41.4
N$1
  Bottom 0.203: BTN4.2A 1.81,5.33 | 1.81,5.33 1.81,7.62 | 1.81,7.62 BTN4.1A | 1.81,7.62 R5.2 | 1.81,5.33 R4.2
N$2
  Bottom 0.305: R34.2 36.58,37.34 37.08,36.83 DISP1.8
N$3
  Bottom 0.203: R38.2 VR1.2
N$4
  Bottom 0.203: BTN1.2A 24.67,5.33 | 24.67,5.33 24.67,7.62 | 24.67,7.62 BTN1.1A | 24.67,7.62 R8.2 | 24.67,5.33 R1.2
N$5
  Bottom 0.203: BTN2.2A 17.05,5.33 | 17.05,5.33 17.05,7.62 | 17.05,7.62 BTN2.1A | 17.05,7.62 R7.2 | 17.05,5.33 R2.2
N$6
  Bottom 0.203: BTN3.2A 9.43,5.33 | 9.43,5.33 9.43,7.62 | 9.43,7.62 BTN3.1A | 9.43,7.62 R6.2 | 9.43,5.33 R3.2
N$11  (via drill 0.23 pad 0.61)
  Top 0.203: v48.51,6.86 LD4.C
  Bottom 0.203: R12.2 49.28,7.62 v48.51,6.86
N$12  (via drill 0.23 pad 0.61)
  Top 0.203: v52.32,6.86 LD3.C
  Bottom 0.203: R11.2 53.09,7.62 v52.32,6.86
N$13  (via drill 0.23 pad 0.61)
  Top 0.203: v56.13,6.86 LD2.C
  Bottom 0.203: R10.2 56.9,7.62 v56.13,6.86
N$14  (via drill 0.23 pad 0.61)
  Top 0.203: v59.94,6.86 LD1.C
  Bottom 0.203: R9.2 60.71,7.62 v59.94,6.86
N$15
  Bottom 0.305: DISP1.1 38.63,32.28 38.35,32 38.35,31.25 C3.2
N$16
  Bottom 0.305: DISP1.15 37.87,41.38 37.34,41.91 C7.1
N$17
  Bottom 0.305: DISP1.2 38.26,32.93 37.59,32.26 37.59,31.74 37.59,31.75 36.84,31 C3.1
N$18
  Bottom 0.305: DISP1.14 36.4,40.73 C6.1
N$19
  Bottom 0.305: DISP1.3 37.89,33.58 C8.2
N$20
  Bottom 0.305: DISP1.13 37.54,40.08 36.83,39.37 R33.2
N$21
  Bottom 0.305: DISP1.4 37.54,34.23 C8.1
N$22
  Bottom 0.203: R20.2 15.74,21.09 SW4.2
N$23
  Bottom 0.203: R15.1 60.96,21.08 64.77,24.89 64.77,39.37 J11.4 J11.3
N$24
  Bottom 0.203: R16.1 60.96,17.27 62.48,18.8 66.8,18.8 67.82,19.81 67.82,41.4 J11.2 J11.1
N$25
  Bottom 0.203: R19.2 23.36,21.09 SW3.2
N$26
  Bottom 0.203: R18.2 30.98,21.09 SW2.2
N$27
  Bottom 0.203: R17.2 38.6,21.09 SW1.2
N$29
  Bottom 0.406: DISP1.7 33.89,36.18 33.53,35.81 C5.1 32.76,35.55 31.62,34.42 Q3.3
N$34
  Bottom 1.27: 13.72,33.02 13.72,27.18 11.94,25.4 | 13.72,33.02 JP1.2 | 11.94,21.84 11.94,25.4 | 11.94,21.84 13.21,20.57 13.21,14.99 12.19,13.97 D7.1 | D8.1 11.68,21.59 11.94,21.84 | 11.94,25.4 D5.1 | 13.72,33.02 D6.1
  Bottom 1.778: JP1.2 7.11,36.83 | 7.11,36.83 3.85,36.83 J6.1 | 7.11,36.83 C9.1
N$36
  pour Bottom (rank 3): 2.79,22.61 7.37,22.61 7.37,18.03 2.29,18.03 2.29,22.61
N$37
  pour Bottom (rank 3): 2.29,17.53 7.37,17.53 7.37,12.7 2.29,12.7
N$38
  pour Bottom (rank 3): 2.29,28.96 7.37,28.96 7.37,24.13 2.29,24.13
N$39
  pour Bottom (rank 3): 2.29,34.04 7.37,34.04 7.37,29.46 2.29,29.46
N$40
  Bottom 0.203: Q2.4 9.08,28.26 9.91,27.43 R28.2 R21.2
N$41
  Bottom 0.203: Q2.2 9.21,29.53 9.65,29.97 R27.2 R22.2
N$42
  Bottom 0.203: Q1.4 9.08,16.83 9.91,16 R26.2 R23.2
N$43
  Bottom 0.203: Q1.2 9.21,18.1 9.65,18.54 R25.2 R24.2
N$53  (via drill 0.23 pad 0.61)
  Top 0.203: v44.7,6.86 LD5.C
  Bottom 0.203: R29.2 45.47,7.62 v44.7,6.86
N$58  (via drill 0.23 pad 0.61)
  Top 0.203: v40.89,6.86 LD6.C
  Bottom 0.203: R30.2 41.66,7.62 v40.89,6.86
N$61  (via drill 0.23 pad 0.61)
  Top 0.203: v37.08,6.86 LD7.C
  Bottom 0.203: R31.2 37.85,7.62 v37.08,6.86
N$63  (via drill 0.23 pad 0.61)
  Top 0.203: v33.27,6.86 LD8.C
  Bottom 0.203: R32.2 34.04,7.62 v33.27,6.86
N$83
  Bottom 0.203: JP3.2 66.04,16.76 R14.1
N$84
  Bottom 0.203: JP2.2 66.04,21.58 R13.1
OC1/RD0  (via drill 0.23 pad 0.61)
  Top 0.203: v11.43,28.96 12.19,29.72 12.19,32 9.4,34.8 9.4,43.43 8.38,44.45 8.38,49.49 J9.2 11.39,52.58 54.1,52.58 J2.7
  Bottom 0.203: R21.1 v11.43,28.96 | J9.2 8.38,49.53
OC2/RD1  (via drill 0.23 pad 0.61)
  Top 0.203: v11.43,31.5 8.13,34.8 8.13,42.93 3.34,47.71 J9.1
  Bottom 0.203: R22.1 v11.43,31.5 | J2.11 49.02,52.58 6.39,52.58 J9.1
OC3/RD2  (via drill 0.23 pad 0.61)
  Top 0.203: v11.43,17.53 12.19,18.29 12.19,26.16 14.22,28.19 14.22,32.77 11.94,35.05 11.94,42.42 18.29,48.77 18.29,48.73 J10.2 21.55,52.07 46.99,52.07 J2.13
  Bottom 0.203: R23.1 v11.43,17.53
OC4/RD3  (via drill 0.23 pad 0.61)
  Top 0.203: v11.43,20.07 11.43,26.92 13.21,28.7 13.21,32.26 10.67,34.8 10.67,43.43 13.97,46.74 13.97,49.49 J10.1
  Bottom 0.203: R24.1 v11.43,20.07 | 14.01,49.49 J10.1 16.55,52.07 37.85,52.07 J1.3
PMA8/U2TX/SCL2/CN18/RF5
  Bottom 0.203: R37.1 30.99,31.75 30.48,32.26 30.48,33.78 | 30.48,33.78 26.42,37.85 J1.14 | 30.48,33.78 Q3.2
PMA9/U2RX/SDA2/CN17/RF4  (via drill 0.23 pad 0.61)
  Top 0.203: v28.96,43.18 v42.93,43.18
  Bottom 0.203: DISP1.10 41.94,38.13 42.93,39.12 v42.93,43.18 | v28.96,43.18 J1.12
PMD0/RE0  (via drill 0.23 pad 0.61)
  Top 0.203: LD1.A v59.94,10.92
  Bottom 0.203: v59.94,10.92 58.42,12.45 56.64,12.45 56.13,12.95 56.13,20.57 61.72,26.16 61.72,46.48 J2.2
PMD1/RE1  (via drill 0.23 pad 0.61)
  Top 0.203: LD2.A v56.13,10.92
  Bottom 0.203: v56.13,10.92 55.37,11.68 55.63,21.84 60.71,26.92 60.45,47.75 J2.4
PMD2/RE2  (via drill 0.23 pad 0.61)
  Top 0.203: LD3.A v52.32,10.92
  Bottom 0.203: v52.32,10.92 52.32,14.22 54.36,16.26 54.36,22.35 59.18,27.18 59.18,47.5 J2.6
PMD3/RE3  (via drill 0.23 pad 0.61)
  Top 0.203: LD4.A v48.51,10.92
  Bottom 0.203: v48.51,10.92 48.51,14.99 49.53,16 49.53,19.3 57.91,27.69 57.91,46.23 J2.8
PMD4/RE4  (via drill 0.23 pad 0.61)
  Top 0.203: LD5.A v44.7,10.92
  Bottom 0.203: v44.7,10.92 44.7,16.26 56.64,28.19 56.64,45.21 53.59,48.26 J2.10
PMD5/RE5  (via drill 0.23 pad 0.61)
  Top 0.203: LD6.A v40.89,10.92
  Bottom 0.203: v40.89,10.92 40.89,14.22 55.37,28.7 55.37,44.2 51.31,48.26 J2.12
PMD6/RE6  (via drill 0.23 pad 0.61)
  Top 0.203: LD7.A v37.08,10.92
  Bottom 0.203: v37.08,10.92 37.08,12.19 54.36,29.46 54.36,43.69 51.31,46.74 49.78,46.74 J2.14
PMD7/RE7  (via drill 0.23 pad 0.61)
  Top 0.203: LD8.A v33.27,10.92
  Bottom 0.203: v33.27,10.92 34.04,10.92 46.99,23.88 46.99,46.99 J2.16
PMRD/CN14/RD5  (via drill 0.23 pad 0.61)
  Top 0.203: v22.61,44.7 38.1,44.7 J1.2
  Bottom 0.203: R7.1 19.55,16.25 21.34,18.03 21.34,26.92 22.61,28.19 v22.61,44.7
RF1  (via drill 0.23 pad 0.61)
  Top 0.203: J2.9 52.07,49.53 52.07,47.75 51.05,46.74 v45.72,46.74
  Bottom 0.203: R8.1 27.17,10.41 35.81,19.05 40.64,19.05 45.72,24.13 v45.72,46.74
SCK/RG6  (via drill 0.23 pad 0.61)
  Top 0.203: J4.3 46.74,27.94 42.93,31.75 42.93,37.85 v41.66,39.12 40.64,38.1 v30.23,38.1
  Bottom 0.203: DISP1.11 41.32,38.78 v41.66,39.12 | v30.23,38.1 30.23,49.53 J1.11
SCL1/RG2
  Top 0.203: J3.6 65.53,2.54 67.06,4.06 67.06,7.62 65.6,9.07 IC2.2 65.6,12.12 67.31,13.83 67.31,15.49 66.55,16.26 64.77,16.26 JP3.1
  Bottom 0.203: IC1.6 58.74,14.91 59.69,13.97 60.71,13.97 60.96,14.22 R16.2 61.48,14.74 61.72,14.99 61.72,16.76 62.48,17.53 JP3.1
SDA1/RG3
  Top 0.203: J3.5 62.23,1.27 65.28,1.27 67.56,3.56 67.56,8.13 66.29,9.4 66.29,11 IC2.1 66.25,11.64 67.82,13.21 67.82,18.29 66.8,19.3 64.77,19.3 JP2.1
  Bottom 0.203: IC1.5 59.4,16.72 60.96,18.29 R15.2 61.22,18.55 63.25,20.57 JP2.1
SS/RG9  (via drill 0.23 pad 0.61)
  Top 0.203: J4.5 48.01,25.4 41.91,31.5 v41.91,37.34 | v32.77,49.53 35.31,49.53 J1.5
  Bottom 0.203: v41.91,37.34 41.77,37.48 DISP1.9 37.2,37.48 36.58,38.1 33.02,38.1 32,39.12 32,45.47 32.77,46.23 v32.77,49.53
U1RTS/RCLK1/SCK1/INT0/RF6  (via drill 0.23 pad 0.61)
  Top 0.203: v35.56,34.8 33.78,36.58 33.27,37.08 v33.02,37.08
  Bottom 0.203: Q3.5 34.54,33.78 34.8,34.04 R36.1 35.31,34.55 v35.56,34.8 | v33.02,37.08 31.24,38.86 31.24,48.01 J1.10
VBAT
  Bottom 0.406: DISP1.5 36.91,34.88 35.18,33.15 34.8,33.15 | 34.8,33.15 Q3.6 33.78,33.08 | C4.1 34.8,33.15
VCC3V3  (via drill 0.23 pad 0.61)
  Top 0.406: v65.79,4.57 65.78,4.58 C2.1 66.25,5.55 IC2.8
  Bottom 0.203: BTN1.2B BTN1.1B | BTN2.2B BTN2.1B | BTN3.2B BTN3.1B | BTN4.2B BTN4.1B | R13.2 v63.5,22.35 | R14.2 v63.5,16 | v62.74,9.91 R35.2 | R37.2 32.76,32.27 v32.26,32.77 | R36.2 34.28,35.55 34.04,35.31 33.78,35.31 v33.53,35.05
  Bottom 0.406: v57.15,13.46 v57.16,13.47 C1.1 57.15,14.48 57.45,14.77 IC1.8 | Q3.4 33.47,34.99 v33.53,35.05 | Q3.1 31.88,33.15 v32.26,32.77
  pour Route2 (rank 2): 0,53.34 68.58,53.34 68.58,0 0,0
VCC5V0
  Top 1.778: J5.3 38.1,5.08 30.99,5.08 30.99,7.37 19.3,7.37 19.3,39.37 JP1.1
(copper drawn outside any net)
  shapes: Route15 area x1, Route2 area x1

### Text on the board
tPlace: A | G | 9 | 8 | 7 | 6 | 5 | 4 | 3 | 2 | 1 | 0 | 13 | 12 | 11 | 10 | 5 | 3 | 9 | 6 | 27 | 41 | 40 | 39 | 38 | 37 | 36 | 35 | 34 | 33 | 32 | 31 | 30 | 29 | 28 | VDD | SCL | 1 | 38 | - | SDA | VBAT | 40 | GND | RES# | + | 12V Max! | 10 | DISP1 | 3V3 | D/C# | 39 | SCLK | 1 | 5 | 13 | SDI | NC | BASIC IO | SHIELD | SDIN | 11 | SCK | SDO | 3 | SS | GND | 9 | 2 | SDA | I C | PULLUPS | SCL | 6 | A0 | 35 | 8 | 7 | 2 | G | A | 33 | 32 | 31 | 30 | 29 | 28 | 27 | 26 | A0 | A1 | A2 | A3 | A4 | A5 | RST | 3V3 | 5V0 | GND | GND | VIN | 37 | 36 | 34 | 4
bPlace: REV C | PB200-216
Measures: 0.2" X 0.5" | CUTOUT | 2.1" | 2.7"